# EAGLE schematic test-sensior-platiene (EAGLE 9.6.1)
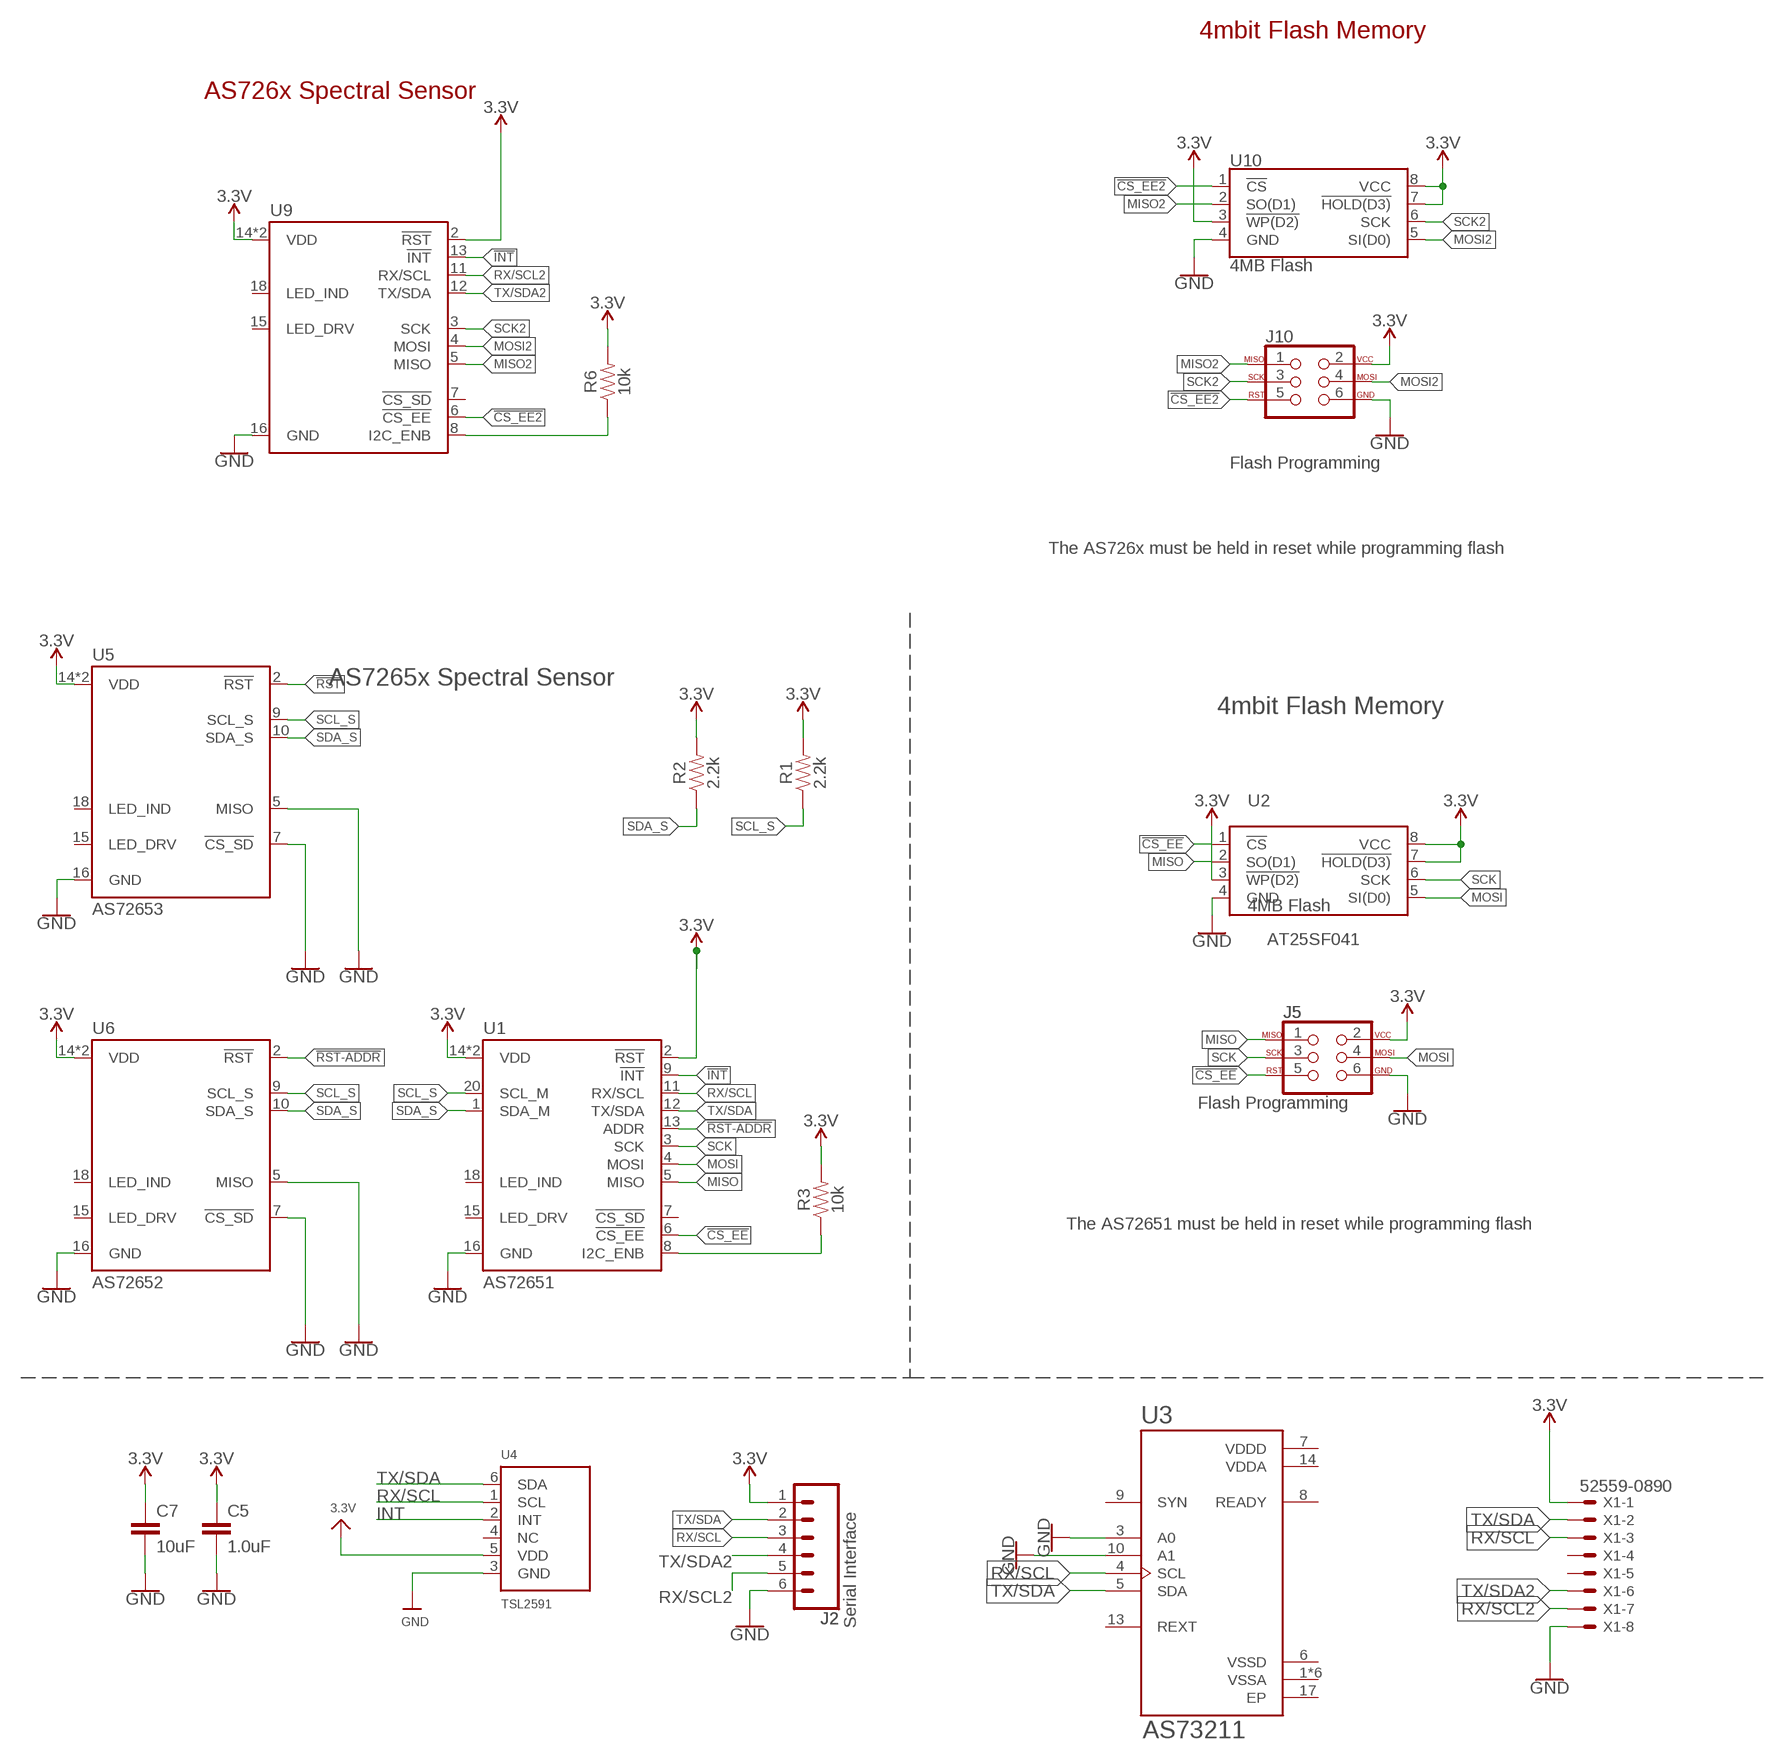
[diagram p0: schematic, sheet 1]

## Parts
C5  1.0uF  1.0UF-0603-16V-10%  [0603]
C7  10uF  10UF-0603-6.3V-20%  [0603]
J2  Serial Interface  CONN_06NO_SILK_FEMALE_PTH  [1X06_NO_SILK]
J5  Flash Programming  AVR_SPI_PROG_3X2TESTPOINTS  [2X3_TEST_POINTS]
J10  Flash Programming  AVR_SPI_PROG_3X2TESTPOINTS  [2X3_TEST_POINTS]
R1  2.2k  2.2KOHM-0603-1/10W-1%  [0603]
R2  2.2k  2.2KOHM-0603-1/10W-1%  [0603]
R3  10k  10KOHM-0603-1/10W-1%  [0603]
R6  10k  10KOHM-0603-1/10W-1%  [0603]
U1  AS72651  [LGA20]
U2  4MB Flash  AT25SF041  [SO08]
U3  AS73211  [QFN65P400X400X100-17N]
U4  TSL2591  LIGHT_TSL2591  [DFN6_TAOS]
U5  AS72653  [LGA20]
U6  AS72652  [LGA20]
U9  IR  AS726XIR  [LGA20]
U10  4MB Flash  AT25SF041  [SO08]
X1  52559-0890  [52559-0890]

## Nets
3.3V [Power]: C5.1 C7.1 J2.1 J5.2 J10.2 R1.2 R2.2 R3.2 R6.2 U1.2(!RST) U1.14(VDD) U1.17(VDD) U2.3(!WP(D2)) U2.7(!HOLD(D3)) U2.8(VCC) U4.5(VDD) U5.14(VDD) U5.17(VDD) U6.14(VDD) U6.17(VDD) U9.2(!RST) U9.14(VDD) U9.17(VDD) U10.3(!WP(D2)) U10.7(!HOLD(D3)) U10.8(VCC) X1.1
!CS_EE: J5.5 U1.6(!CS_EE) U2.1(!CS)
!CS_EE2: J10.5 U9.6(!CS_EE) U10.1(!CS)
!INT: U1.9(!INT) U9.13(!INT)
!RST: U5.2(!RST)
!RST-ADDR: U1.13(ADDR) U6.2(!RST)
GND: C5.2 C7.2 J2.6 J5.6 J10.6 U1.16(GND) U2.4(GND) U3.3(A0) U3.10(A1) U4.3(GND) U5.5(MISO) U5.7(!CS_SD) U5.16(GND) U6.5(MISO) U6.7(!CS_SD) U6.16(GND) U9.16(GND) U10.4(GND) X1.8
I2C_ENB: R3.1 U1.8(I2C_ENB)
INT: U4.2(INT)
MISO: J5.1 U1.5(MISO) U2.2(SO(D1))
MISO2: J10.1 U9.5(MISO) U10.2(SO(D1))
MOSI: J5.4 U1.4(MOSI) U2.5(SI(D0))
MOSI2: J10.4 U9.4(MOSI) U10.5(SI(D0))
N$3: R6.1 U9.8(I2C_ENB)
RX/SCL: J2.3 U1.11(RX/SCL) U3.4(SCL) U4.1(SCL) X1.3
RX/SCL2: J2.5 U9.11(RX/SCL) X1.7
SCK: J5.3 U1.3(SCK) U2.6(SCK)
SCK2: J10.3 U9.3(SCK) U10.6(SCK)
SCL_S: R1.1 U1.20(SCL_M) U5.9(SCL_S) U6.9(SCL_S)
SDA_S: R2.1 U1.1(SDA_M) U5.10(SDA_S) U6.10(SDA_S)
TX/SDA: J2.2 U1.12(TX/SDA) U3.5(SDA) U4.6(SDA) X1.2
TX/SDA2: J2.4 U9.12(TX/SDA) X1.6
Unconnected: U1.7(!CS_SD) U1.15(LED_DRV) U1.18(LED_IND) U3.8(READY) U3.9(SYN) U3.13(REXT) U4.4(NC) U5.15(LED_DRV) U5.18(LED_IND) U6.15(LED_DRV) U6.18(LED_IND) U9.7(!CS_SD) U9.15(LED_DRV) U9.18(LED_IND) X1.4 X1.5

## Notes on the sheet
- 4mbit Flash Memory
- AS726x Spectral Sensor
- The AS726x must be held in reset while programming flash
- AS7265x Spectral Sensor
- 4mbit Flash Memory
- AT25SF041
- The AS72651 must be held in reset while programming flash

## Power pins joined to a net without a drawn wire
EP: U3.17(EP)
VDDA: U3.14(VDDA)
VDDD: U3.7(VDDD)
VSSA: U3.1(VSSA) U3.2(VSSA) U3.11(VSSA) U3.12(VSSA) U3.15(VSSA) U3.16(VSSA)
VSSD: U3.6(VSSD)

## Library data of the parts
C5 = SparkFun-Capacitors:1.0UF: 1µF ceramic capacitors A capacitor is a passive two-terminal electrical component used to store electrical energy temporarily in an electric field.; PROD_ID: CAP-00868
C7 = SparkFun-Capacitors:10UF: 10.0µF ceramic capacitors A capacitor is a passive two-terminal electrical component used to store electrical energy temporarily in an electric field.; PROD_ID: CAP-11015
J2 = SparkFun-Connectors:CONN_06: Multi connection point. Often used as Generic Header-pin footprint for 0.1 inch spaced/style header connections On any of the 0.1 inch spaced packages, you can populate with these: Break Away Headers - Straight <https://www.sparkfun.com/products/116> (PRT-00116) Break Away Male Headers - Right Angle <https://www.sparkfun.com/products/553> (PRT-00553) Female Headers <https://www.sparkfun.com/products/115> (PRT-00115) Break Away Headers - Machine Pin <https://www.sparkfun.com/products/117> (PRT-00117) Break Away Female Headers - Swiss Machine Pin <https://www.sparkfun.com/products/743> (PRT-00743) Arduino Stackable Header - 6 Pin <https://www.sparkfun.com/products/9280> (PRT-09280) For SCREWTERMINALS and SPRING TERMINALS visit here: Screw Terimnals on SparkFun.com <https://www.sparkfun.com/search/results?term=Screw+Terminals> (5mm/3.5mm/2.54mm spacing) This device is also useful as a general connection point to wire up your design to another part of your project. Our various solder wires solder well into these plated through hole pads. Hook-Up Wire - Assortment (Stranded, 22 AWG) <https://www.sparkfun.com/products/11375> (PRT-11375) Hook-Up Wire - Assortment (Solid Core, 22 AWG) <https://www.sparkfun.com/products/11367> (PRT-11367) View the entire wire category on our website here <https://www.sparkfun.com/categories/141>; PROD_ID: CONN-08437
J5 J10 = SparkFun-Connectors:AVR_SPI_PROG_3X2: AVR ISP 6 Pin This is the reduced ISP connector for AVR programming. Common on Arduino. This footprint will take up less PCB space and can be used with a 10-pin to 6-pin adapter such as SKU: BOB-08508 **Special note about "TEST_POINT" package. The stop mask is on the top side, so if you want your programming test points to be on the bottom of your board, make sure to place this package on the bottom side of the board. This also ensure that the orientation to program from the bottom side will be correct. SparkFun Products: SparkFun ISP Pogo Adapter <https://www.sparkfun.com/products/11591> - NS Tiny AVR Programmer <https://www.sparkfun.com/products/11801> -PTH
R1 R2 = SparkFun-Resistors:2.2KOHM: 2.2kΩ resistor A resistor is a passive two-terminal electrical component that implements electrical resistance as a circuit element. Resistors act to reduce current flow, and, at the same time, act to lower voltage levels within circuits. - Wikipedia; PROD_ID: RES-08272
R3 R6 = SparkFun-Resistors:10KOHM: 10kΩ resistor A resistor is a passive two-terminal electrical component that implements electrical resistance as a circuit element. Resistors act to reduce current flow, and, at the same time, act to lower voltage levels within circuits. - Wikipedia; PROD_ID: RES-00824
U1 = Qwiic_Spectral_Sensor-AS7265x:AS72651; PROD_ID: IC-14127
U2 U10 = SparkFun-IC-Memory:AT25SF041: AT25SF041 4Mb Serial Flash Memory 104MHz, SPI, 8-SOIC Datasheet <http://www.adestotech.com/wp-content/uploads/DS-AT25SF041_044.pdf> SparkFun Products: SparkFun ESP8266 Thing <https://www.sparkfun.com/products/13231> SparkFun ESP8266 Thing - Dev Board <https://www.sparkfun.com/products/13711>; PROD_ID: IC-12455
U3 = AS73211:AS73211: Ambient Light Sensors AS73211-AQFT QFN16 T&RDP; AVAILABILITY: Unavailable; DESCRIPTION: AS73211 QFN16 Tradp; MF: ams; MP: AS73211; PACKAGE: QFN-16 ams; PRICE: None
U4 = microbuilder:LIGHT_TSL2591: TSL2591 Light-To-Digital Sensor
U5 = Qwiic_Spectral_Sensor-AS7265x:AS72653; PROD_ID: IC-14129
U6 = Qwiic_Spectral_Sensor-AS7265x:AS72652; PROD_ID: IC-14128
U9 = SparkFun-Sensors:AS726X; PROD_ID: IC-13731
X1 = con-molex:52559-0890: FFC/FPC-to-Board 0.50mm (.020") SMT, Vertical, ZIF Receptacle Source: http://www.molex.com/product/ffc/52559.html; MF: MOLEX; OC_FARNELL: unknown; OC_NEWARK: unknown

## Net classes
1 Power: width 0.305 mm